# Altium schematic sheet Shematic.SchDoc
size A2; SheetNumber: 1; SheetTotal: 1
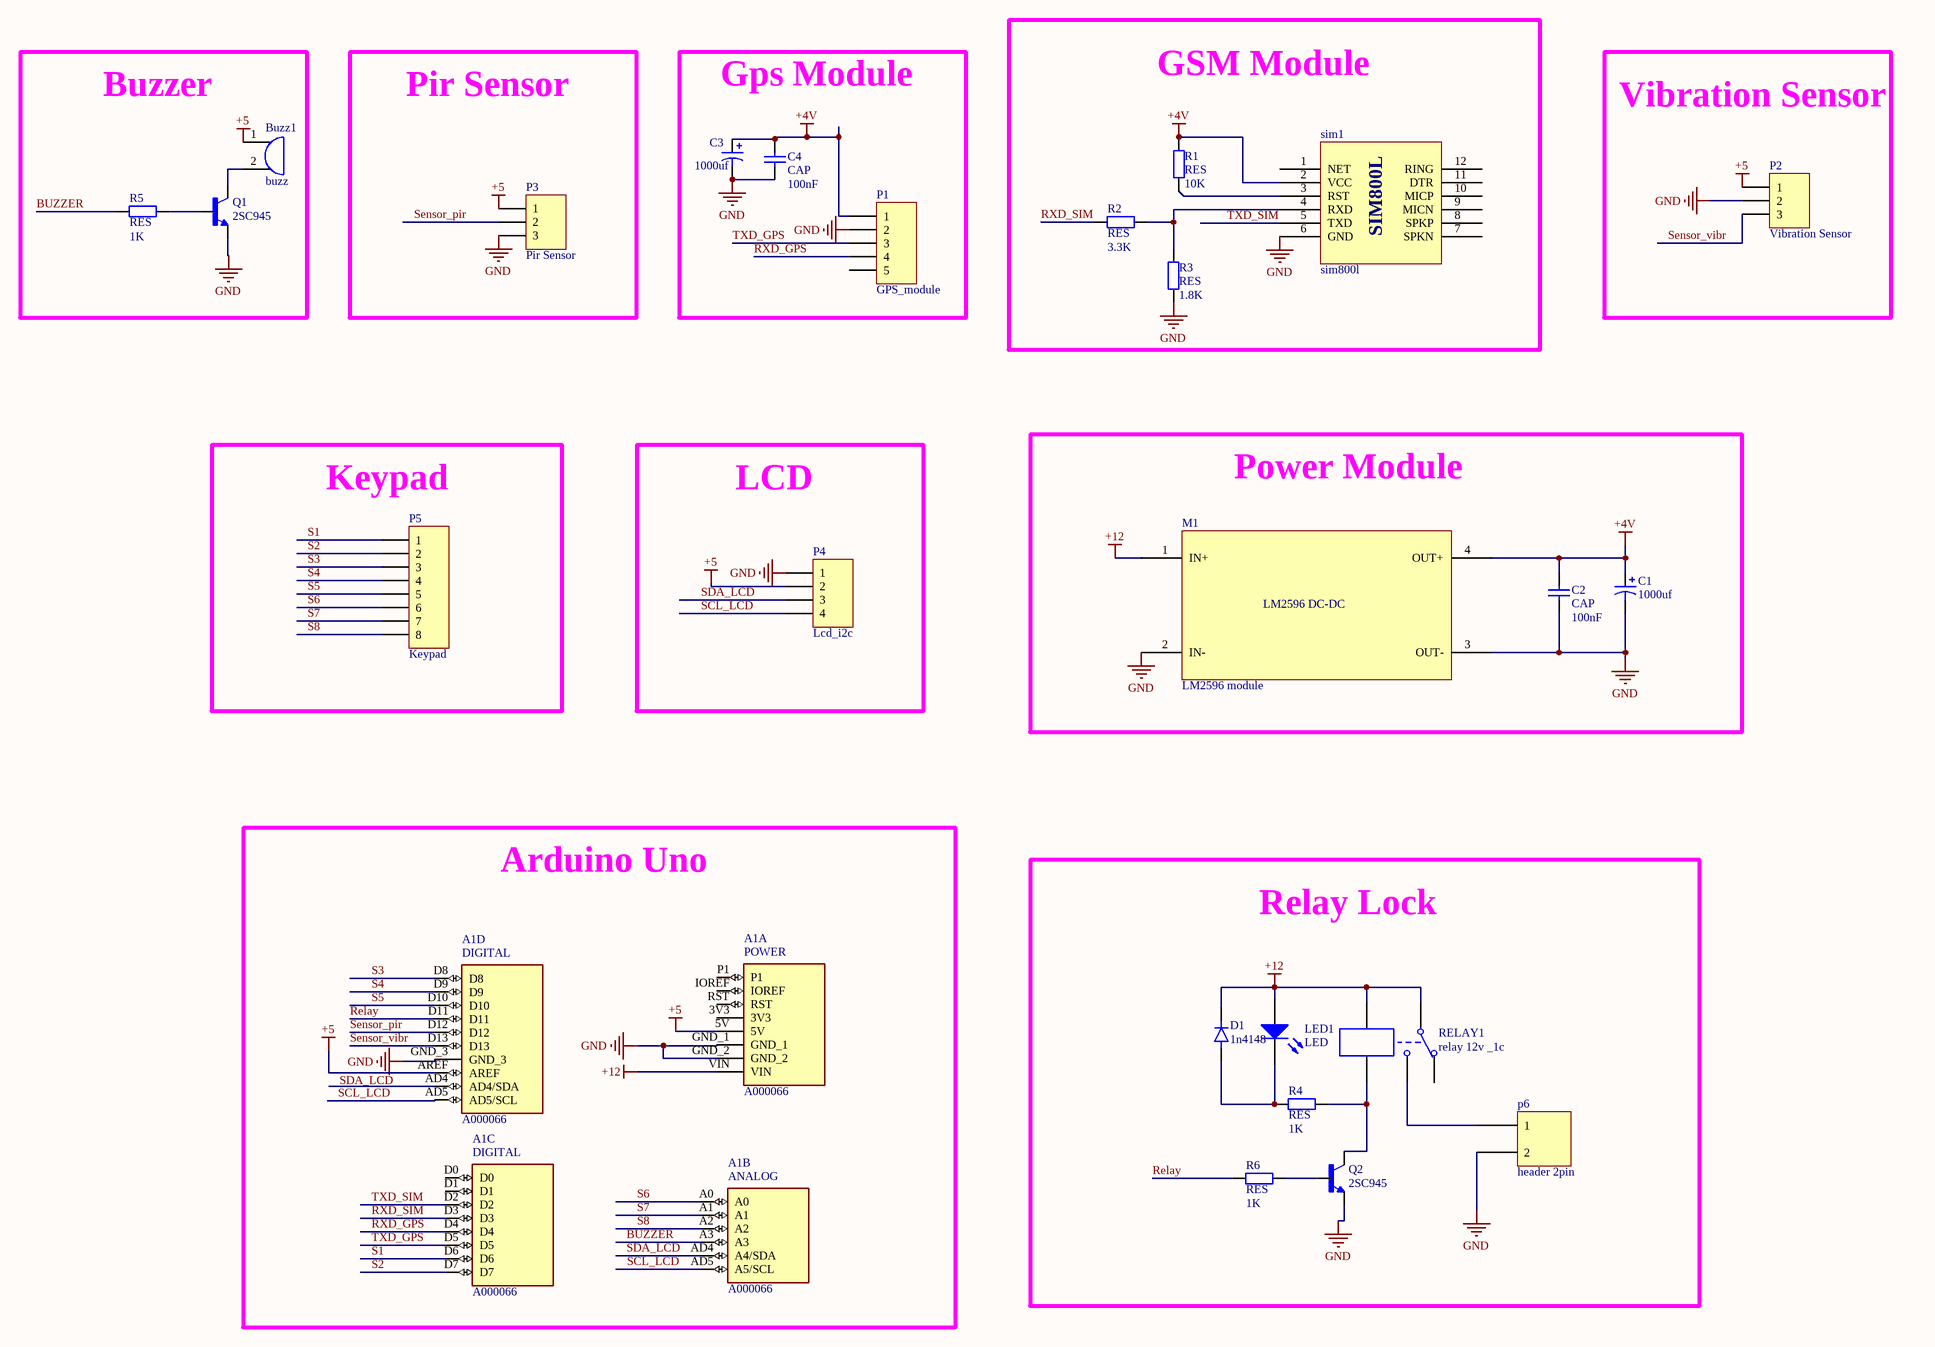
[diagram p0: Shematic.SchDoc]

## Parts
A1  A000066  [ARDUINO_A000066]  (parts A,B,C,D of 4)
Buzz1  buzz  [BUZZ]
C1  1000uf  [CAP_POL5MM]
C2  CAP  Parameter 1: 100nF  [CAP2.54]
C3  1000uf  [CAP_POL5MM]
C4  CAP  Parameter 1: 100nF  [CAP2.54]
D1  1n4148  [do-35]
LED1  LED  [led_5mm]
M1  LM2596 module  [LM2596_modoule]
P1  GPS_module  [HDR1X5]
P2  Vibration Sensor  [HDR1X3]
P3  Pir Sensor  [HDR1X3]
P4  Lcd_i2c  [HDR1X4]
P5  Keypad  [HDR1X8]
p6  header 2pin  [header_2pin]
Q1  2SC945  [SOT95P237X112-3N]
Q2  2SC945  [SOT95P237X112-3N]
R1  RES  value 10K  [C1206]
R2  RES  value 3.3K  [RES_1/4W]
R3  RES  value 1.8K  [RES_1/4W]
R4  RES  value 1K  [C1206]
R5  RES  value 1K  [C1206]
R6  RES  value 1K  [C1206]
RELAY1  relay 12v _1c  [relay 12v 1c]
sim1  sim800l  [SIM800_L]

## Blocks framed on the sheet
Buzzer: Buzz1 Q1 R5
Pir Sensor: P3
Gps Module: C3 C4 P1
GSM Module: R1-R3 sim1
Vibration Sensor: P2
Keypad: P5
LCD: P4
Power Module: C1 C2 M1
Arduino Uno: A1
Relay Lock: D1 LED1 p6 Q2 R4 R6 RELAY1

## Nets
+4V: C1.1 C2.2 C3.1 C4.2 M1.4(OUT+) P1.1 R1.2 sim1.2(VCC)
+5: A1.5V A1.AREF Buzz1.1(+) P2.1 P3.1 P4.2
+12: A1.VIN D1.2(K) LED1.1(A) M1.1(IN+) RELAY1.1 RELAY1.4
GND: A1.GND_1 A1.GND_2 A1.GND_3 C1.2 C2.1 C3.2 C4.1 M1.2(IN-) M1.3(OUT-) P1.2 P2.2 P3.3 P4.1 p6.2 Q1.2(E) Q2.2(E) R3.2 sim1.6(GND)
BUZZER: A1.A3 R5.2
Relay: A1.D11 R6.2
RXD_GPS: A1.D4 P1.4
RXD_SIM: A1.D3 R2.1
S1: A1.D6 P5.1
S2: A1.D7 P5.2
S3: A1.D8 P5.3
S4: A1.D9 P5.4
S5: A1.D10 P5.5
S6: A1.A0 P5.6
S7: A1.A1 P5.7
S8: A1.A2 P5.8
SCL_LCD: A1.AD5(A5/SCL) P4.4
SDA_LCD: A1.AD4(A4/SDA) P4.3
Sensor_pir: A1.D12 P3.2
Sensor_vibr: A1.D13 P2.3
TXD_GPS: A1.D5 P1.3
TXD_SIM: A1.D2 sim1.5(TXD)
NetBuzz1_2: Buzz1.2(-) Q1.3(C)
NetD1_1: D1.1(A) LED1.2(K) R4.2
Netp6_1: p6.1 RELAY1.3
NetQ1_1: Q1.1(B) R5.1
NetQ2_1: Q2.1(B) R6.1
NetQ2_3: Q2.3(C) R4.1 RELAY1.5
NetR1_1: R1.1 sim1.3(RST)
NetR2_2: R2.2 R3.1 sim1.4(RXD)

Not connected (* = marked no-connect by the designer): A1 3V3 D0 D1 IOREF P1 RST; P1 5; RELAY1 2; sim1 1(NET) 7(SPKN) 8(SPKP) 9(MICN) 10(MICP) 11(DTR) 12(RING)

## Notes on the sheet
- Labels drawn without touching a wire or pin: SDA_LCD
- (in symbol A000066, part A) POWER
- (in symbol A000066, part B) ANALOG
- (in symbol A000066, part C) DIGITAL
- (in symbol A000066, part D) DIGITAL
- (in symbol LM2596 module) LM2596 DC-DC
- (in symbol sim800l) SIM800L

## Library data of the parts
A1 = A000066: Microcontroller board based on the ATmega328P.; pin to pad: A4>A4(SDA; MF: Arduino; MP: Arduino Uno Rev3; Value: *; SnapEDA_Link: https://www.snapeda.com/parts/Arduino%20Uno%20Rev3/Arduino/view-part/?ref=snap; Availability: Not in stock; Price: None; Package: Non-Standard Arduino; Check_prices: https://www.snapeda.com/parts/Arduino%20Uno%20Rev3/Arduino/view-part/?ref=eda
C1 C3 = CAP_POL
D1 = 1n4148: Diode Standard 100V 200mA Surface Mount SOD-80; MP: LL4148; MF: ON Semiconductor; Package: SOD-80 Taitron; Availability: Unavailable; Value: *; SnapEDA_Link: https://www.snapeda.com/parts/LL4148/ON%20Semiconductor/view-part/2182678/?ref=snap; Price: None
P1 = Header 5: Header, 5-Pin; LatestRevisionDate: 17-Jul-2002; LatestRevisionNote: Re-released for DXP Platform.; Publisher: Altium Limited
P2 P3 = Header 3: Header, 3-Pin; LatestRevisionDate: 17-Jul-2002; LatestRevisionNote: Re-released for DXP Platform.; Publisher: Altium Limited
P4 = Header 4: Header, 4-Pin; LatestRevisionDate: 17-Jul-2002; LatestRevisionNote: Re-released for DXP Platform.; Publisher: Altium Limited
P5 = Header 8: Header, 8-Pin; LatestRevisionDate: 17-Jul-2002; LatestRevisionNote: Re-released for DXP Platform.; Publisher: Altium Limited
Q1 Q2 = 2SC945: Bipolar _BJT_ Transistor NPN 50V 150mA 150MHz 400mW Through Hole TO-92; MF: Simtek; Package: TO-226-3 Simtek; SnapEDA_Link: https://www.snapeda.com/parts/2SC945/Simtek/view-part/888088/?ref=snap; MP: 2SC945; Value: *; Availability: Unavailable; Price: None